# EAGLE design amp (EAGLE 5.10)
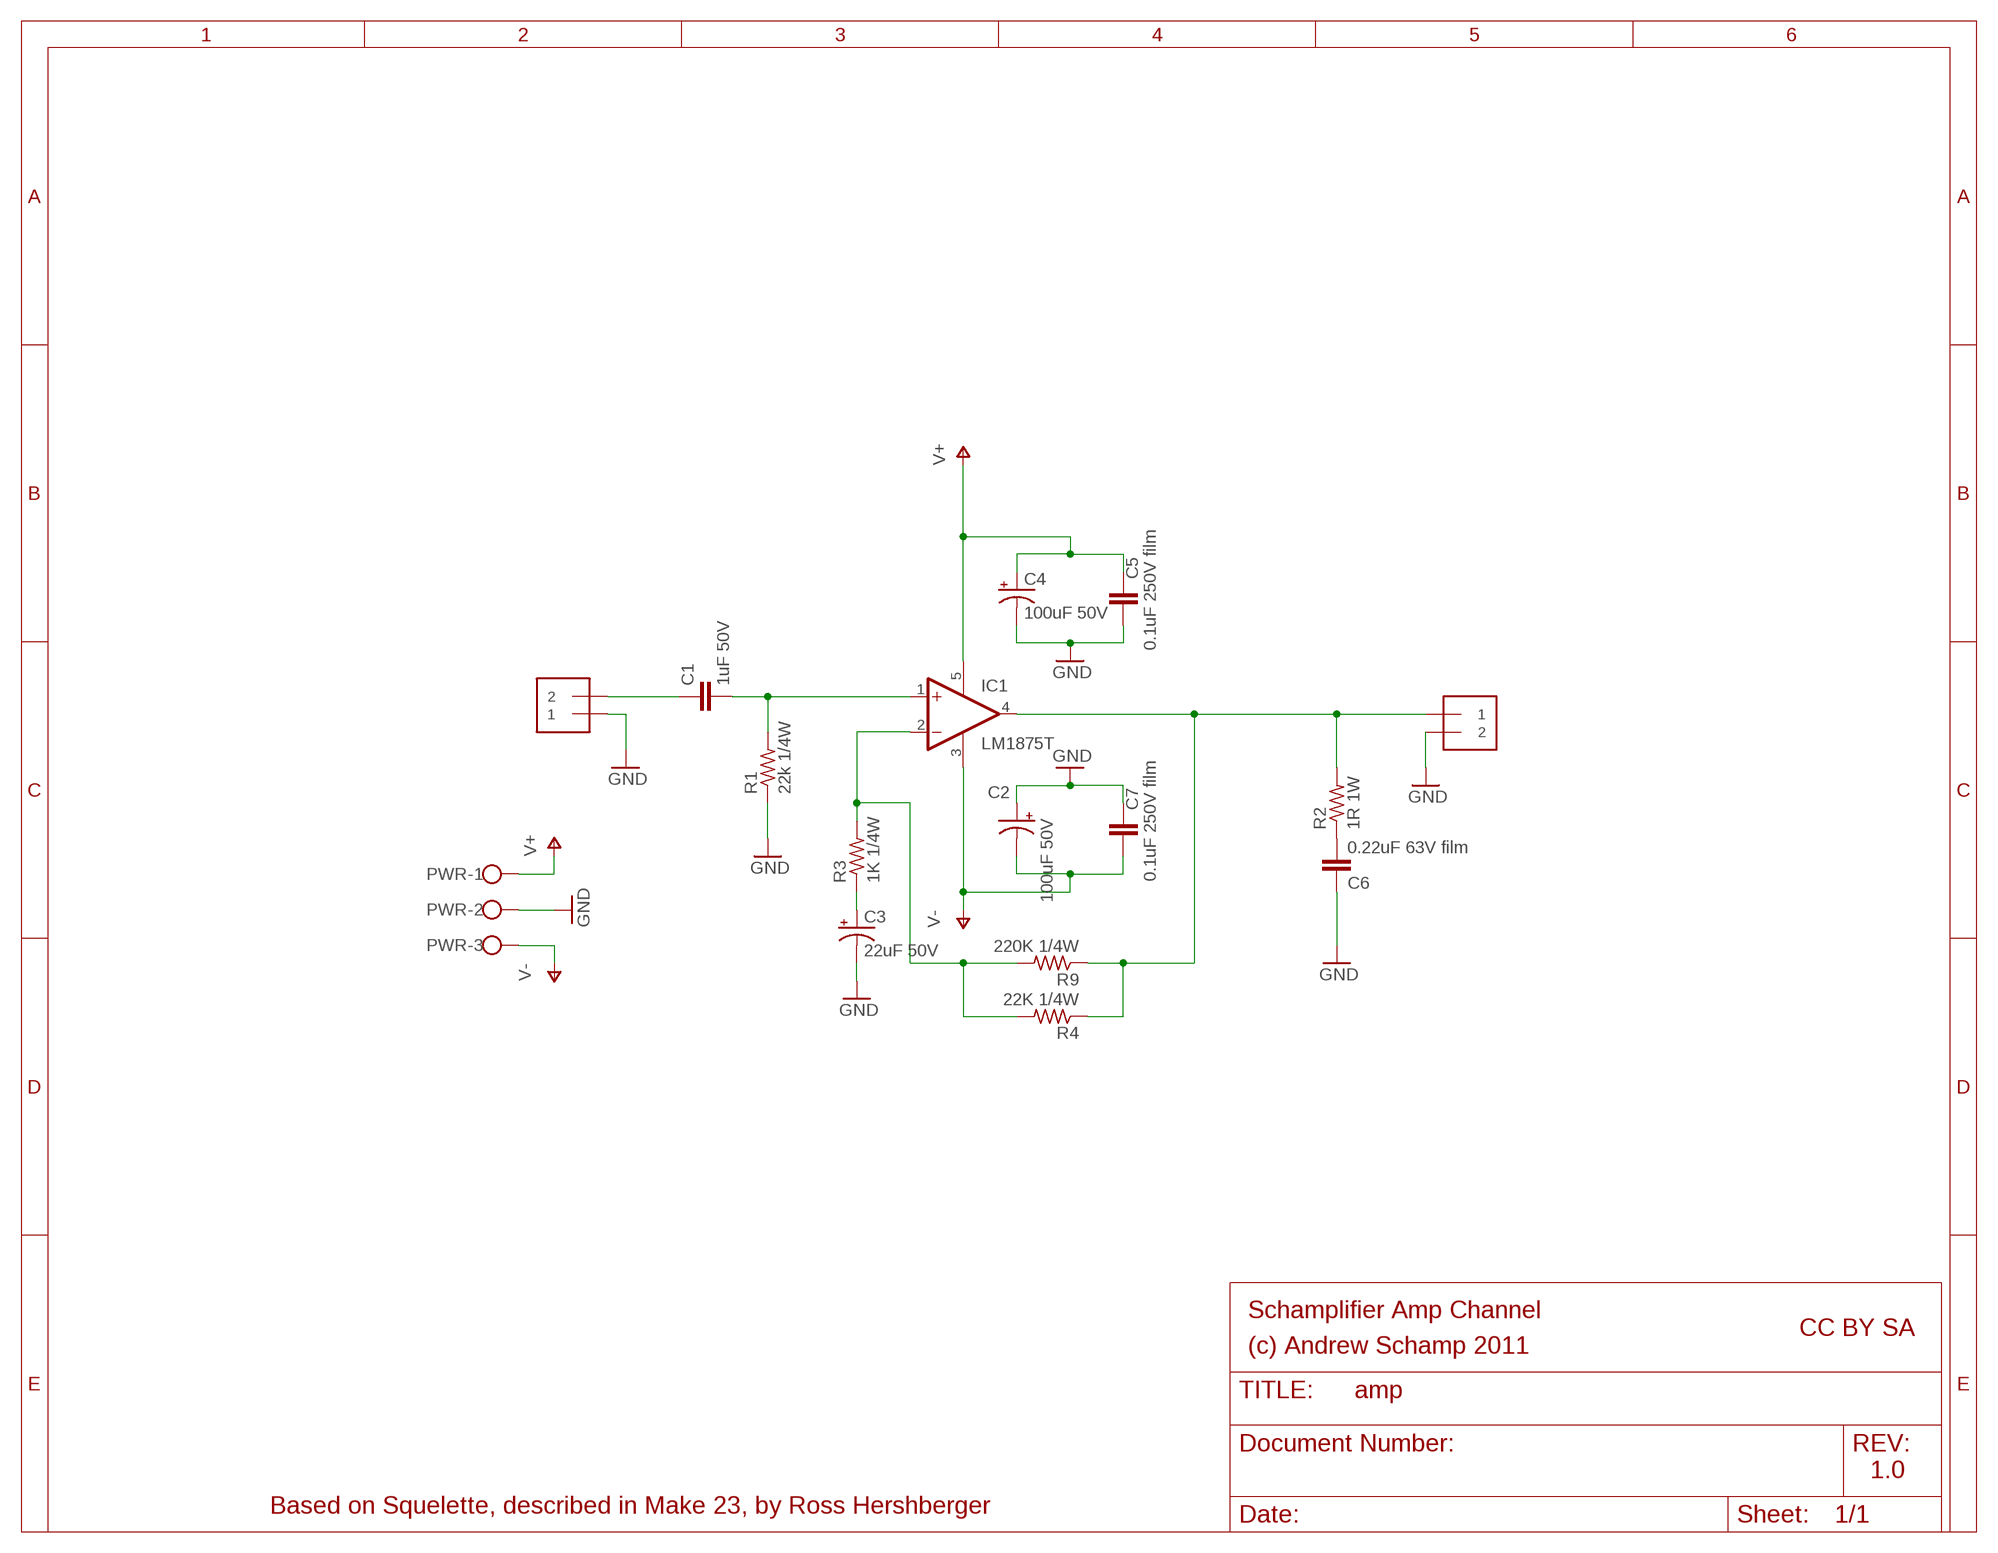
[diagram p0: schematic, sheet 1]

## Parts
C1  1uF 50V  C5/5  [C5B5]
C2  100uF 50V  CPOL-USE2-5  [E2-5]
C3  22uF 50V  CPOL-USE2-5  [E2-5]
C4  100uF 50V  CPOL-USE2-5  [E2-5]
C5  0.1uF 250V film  CAP  [FILM-CAP-12.5X5]
C6  0.22uF 63V film  C5/5  [C5B5]
C7  0.1uF 250V film  CAP  [FILM-CAP-12.5X5]
IC1  LM1875T  [CB367]
LEFT_IN  1X2-3.5MM  [3.5MMTERM]
LEFT_OUT  1X2-3.5MM  [3.5MMTERM]
PWR  W237-03P  [W237-133]
R1  22k 1/4W  R-US_0207/10  [0207/10]
R2  1R 1W  R-US_0613/15  [P0613/15]
R3  1K 1/4W  R-US_R0805  [R0805]
R4  22K 1/4W  R-US_R0805  [R0805]
R9  220K 1/4W  R-US_R0805  [R0805]

## Nets
GND: C2.+ C3.- C4.- C5.P$3 C6.1 C7.P$3 LEFT_IN.1 LEFT_OUT.2 PWR.2 R1.1
N$1: C1.2 IC1.1(+IN) R1.2
N$2: IC1.4(OUT) LEFT_OUT.1 R2.2 R4.1 R9.1
N$4: C3.+ R3.1
N$5: IC1.2(-IN) R3.2 R4.2 R9.2
N$7: C6.2 R2.1
V+: C4.+ C5.P$2 IC1.5(V+) PWR.1
V-: C2.- C7.P$2 IC1.3(V-) PWR.3
W_L: C1.1 LEFT_IN.2

## Notes on the sheet
- Schamplifier Amp Channel
- CC BY SA
- (c) Andrew Schamp 2011
- 1.0
- Based on Squelette, described in Make 23, by Ross Hershberger

## Library data of the parts
C1 C6 = capacitor-wima:C: CAPACITOR naming: grid - package width
C2-C4 = resistor:CPOL-US: POLARIZED CAPACITOR, American symbol
C5 C7 = ideabot:CAP: Capacitor Standard 0603 ceramic capacitor, and 0.1" leaded capacitor.
IC1 = linear:LM1875T: Power OP AMP
LEFT_IN LEFT_OUT = adafruit:1X2: 3.5mm Terminal block http://www.ladyada.net/library/pcb/eaglelibrary.html
PWR = con-wago-508:W237-03P: WAGO SREW CLAMP
R1 R3 R4 R9 = adafruit:R-US_: RESISTOR, American symbol
R2 = resistor:R-US_: RESISTOR, American symbol

## Board
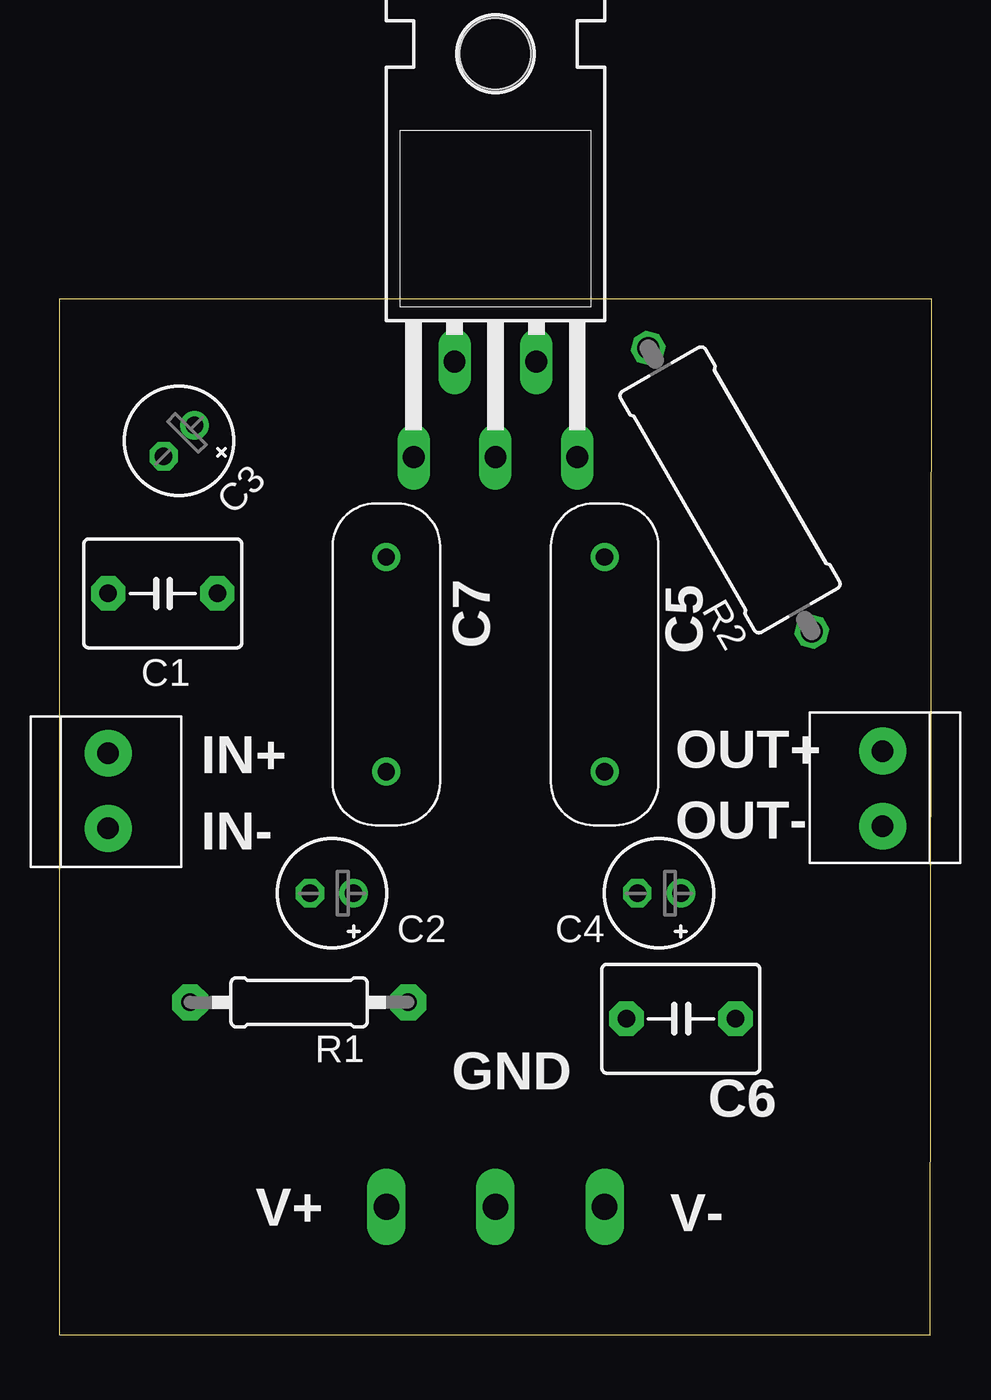
[diagram p1: board, top side]
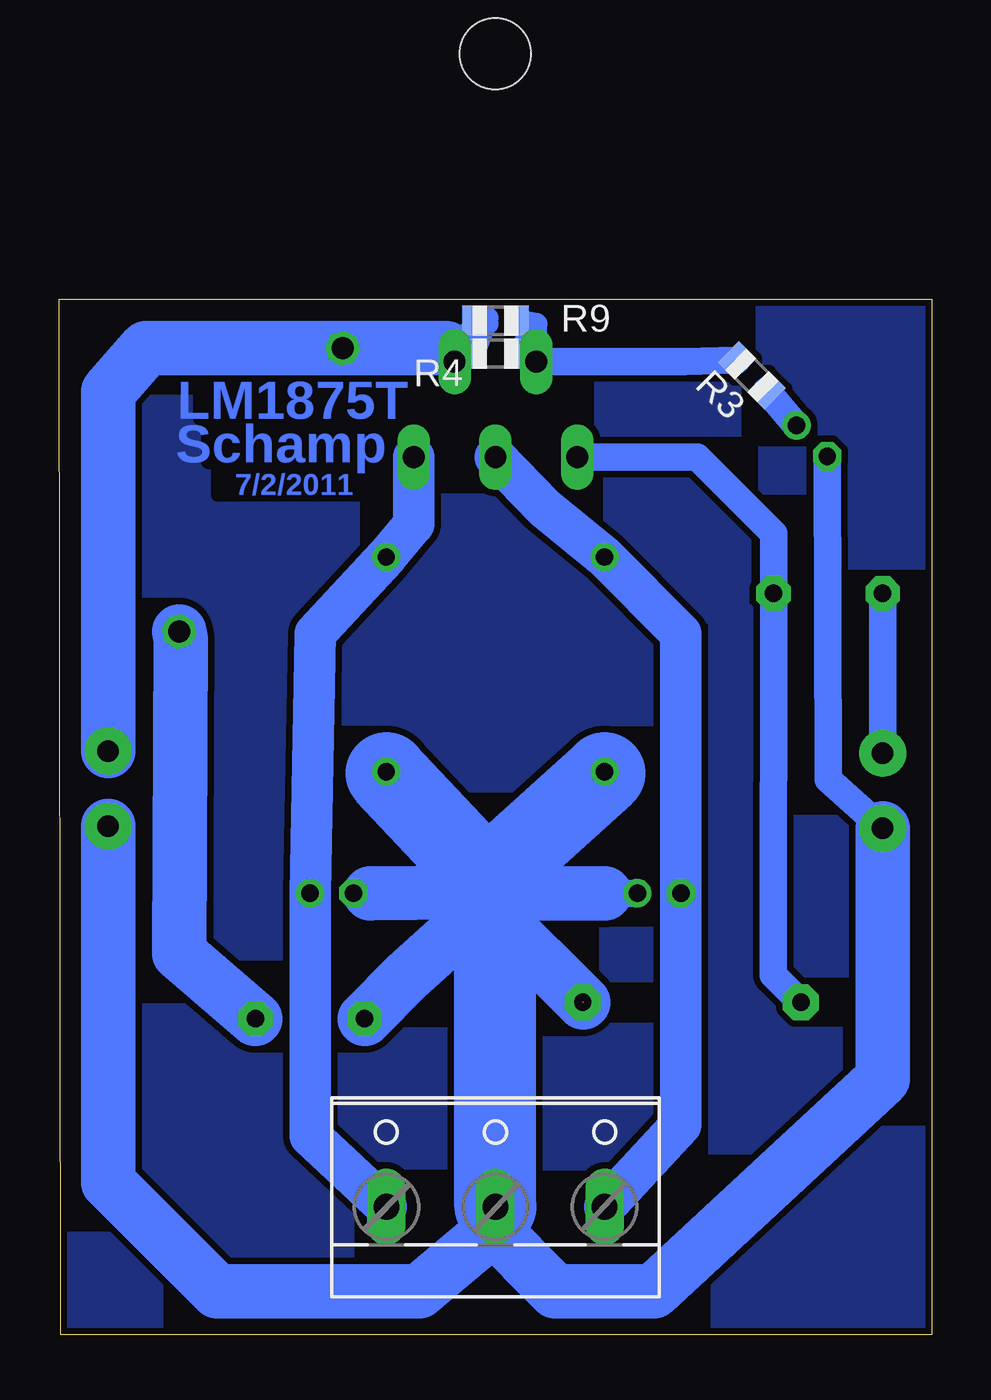
[diagram p2: board, bottom side, seen from below]

Size 40.64 x 48.26 mm. Coordinates in mm from the lower left corner, seen from the top.
Outline: 0,0 40.56,0 40.64,48.26 0,48.26 0,0
Copper layers (1*16): Top 0.035mm / dielectric 1.5mm / Bottom 0.035mm
Design rules "Fusion_eagle_rule_v1.1": minimum track width 6mil, minimum drill 12mil, track to track 6mil, track to pad 6mil, pad to pad 6mil, via to via 6mil, smd to smd 0mil, copper to edge 10mil, drill to drill 10mil, minimum pad ring 10mil, minimum via ring 6mil, stop-mask expansion 2mil, vias tented up to drill 100mil, thermal gap 10mil

### Footprints (pad centres in the part's own frame; a part is rotated, then mirrored left to right if it is on the bottom)
C5B5 = drill 0.813 pad 1.6 octagon: 1 -2.54,0; 2 2.54,0
E2-5 = drill 0.813 pad 1.27 round: + -1.016,0 | drill 0.813 pad 1.27 octagon: - 1.016,0
FILM-CAP-12.5X5 = drill 0.8 round: P$2 5,0; P$3 -5,0
CB367 = drill 1.016 long: 1 -3.81,-11.43; 2 -1.905,-6.985; 3 0,-11.43; 4 1.905,-6.985; 5 3.81,-11.43 | hole 3.302: 0,7.366
3.5MMTERM = drill 1 pad 2.184 round: 1 1.8,0; 2 -1.7,0
W237-133 = drill 1.194 long: 1 -5.08,-0.635; 2 0,-0.635; 3 5.08,-0.635
0207/10 = drill 0.813 pad 1.676 octagon: 1 -5.08,0; 2 5.08,0
P0613/15 = drill 1.016 octagon: 1 -7.62,0; 2 7.62,0
R0805 = smd 1.1 x 1.4: 1 -1,0; 2 1,0

### Placement (x,y rotation side)
C1  4.83,34.54 0 top
C2  12.7,20.57 180 top
C3  5.59,41.66 225 top
C4  27.94,20.57 180 top
C5  25.4,31.24 90 top
C6  28.96,14.73 0 top
C7  15.24,31.24 90 top
IC1  20.32,52.32 0 top
LEFT_IN  2.29,25.4 270 top
LEFT_OUT  38.35,25.4 90 top
PWR  20.32,6.6 0 bottom
R1  11.18,15.49 180 top
R2  31.24,39.37 120 top
R3  8.38,44.7 135 bottom
R4  20.32,45.72 0 bottom
R9  20.32,47.24 0 bottom

### Tracks (layer width: path | path; a pad name or v marks a point on that pad's centre or on a via)
GND  (1 unrouted)
  Bottom 1.27: 15.24,20.57 C2.+ | C3.- 4.83,25.89 LEFT_IN.1 | 26.16,20.57 C4.- | C5.P$3 25.4,26.16
  Bottom 2.54: 15.24,26.16 C7.P$3 | 20.34,21.58 20.83,19.56 | 20.34,21.58 20.3,18.77 20.3,19.54 16.24,15.49 | 20.81,19.34 20.81,19.3 21.83,19.07 24.46,16.68 C6.1 | 20.83,19.56 20.81,19.34 | 26.16,20.57 21.88,20.61 20.81,19.34 | 20.57,21.34 21.59,22.1 20.6,19.83 20.34,21.58 | LEFT_OUT.2 38.35,7.11 33.27,2.03 23.88,2.03 20.64,4.76 20.64,5.15 | 20.64,5.15 PWR.2 | 20.32,18.29 20.6,18.56 20.34,21.58 | 15.24,20.57 19.3,20.57 20.83,19.56 | LEFT_IN.1 2.29,11.94 12.95,2.03 17.52,2.03 20.64,5.15
  Bottom 3.81: 20.57,21.34 15.24,26.16 | 21.59,22.1 25.4,26.16 | PWR.2 20.32,18.29
MASK
  pour Bottom (isolate 0.305): 0.25,48.26 0,0 40.39,0 40.64,48.26
N$1
  Bottom 1.27: IC1.1 10.92,40.89 7.37,37.34 7.37,35.81 C1.2 | C1.2 7.38,17.02 7.38,16.78 R1.2 | C1.2 | C1.2
N$2
  Bottom 1.016: 20.7,47.1 R9.1 | 20.7,47.1 20.7,47.39 R4.1 | IC1.4 20.7,47.1
  Bottom 1.27: IC1.4 21.46,46.61 22.61,45.97
  Bottom 2.54: LEFT_OUT.1 38.35,43.94 36.58,45.97 27.69,45.97 | 27.69,45.97 R2.2 | 27.69,45.97 22.61,45.97
N$4
  Bottom 1.27: C3.+ R3.1
N$5
  Bottom 1.016: 18.41,47.1 R9.2 | IC1.2 18.41,47.1 | 18.41,47.1 18.67,46.62 R4.2
  Bottom 1.27: R3.2 11.56,45.34 IC1.2
N$7
  Bottom 2.54: C6.2 35.05,17.78 34.97,32.41 R2.1
V+
  Bottom 1.93: IC1.5 24.13,37.77 C5.P$2 28.7,32.69 C4.+ 28.96,9.27 PWR.1
V-
  Bottom 1.93: IC1.3 18.03,38.53 C7.P$2 11.68,32.69 C2.- 11.68,9.78 PWR.3
W_L
  Bottom 1.27: LEFT_IN.2 C1.1

### Text on the board
Bottom: LM1875T | Schamp | 7/2/2011
tNames: C7 | C5 | IN+ | OUT+ | IN- | OUT- | GND | C6 | V+ | V-